# Altium schematic sheet NG2092_SD_Card.SchDoc: =project_title
size Tabloid; PageSetup: Record=PageOptions|CenterHorizontal=True|CenterVertical=True|PrintScale=0.73|XCorrection=1.00|YCorrection=1.00|PrintKind=0|BorderSize=5000000|LeftOffset=0|BottomOffset=0|Orientation=2|PaperLength=1000|PaperWidth=1000|Scale=100|PaperSource=7|PrintQuality=-4|MediaType=1|DitherType=10|PaperKind=A4|PrintScaleMode=1; CompanyName: Luxonis Holding; Organization: Luxonis Holding; Address1: 1925 Harmony Park Drive; Address2: Westminster, CO; Address3: 80234; Address4: United States; SheetNumber: 8; SheetTotal: 12
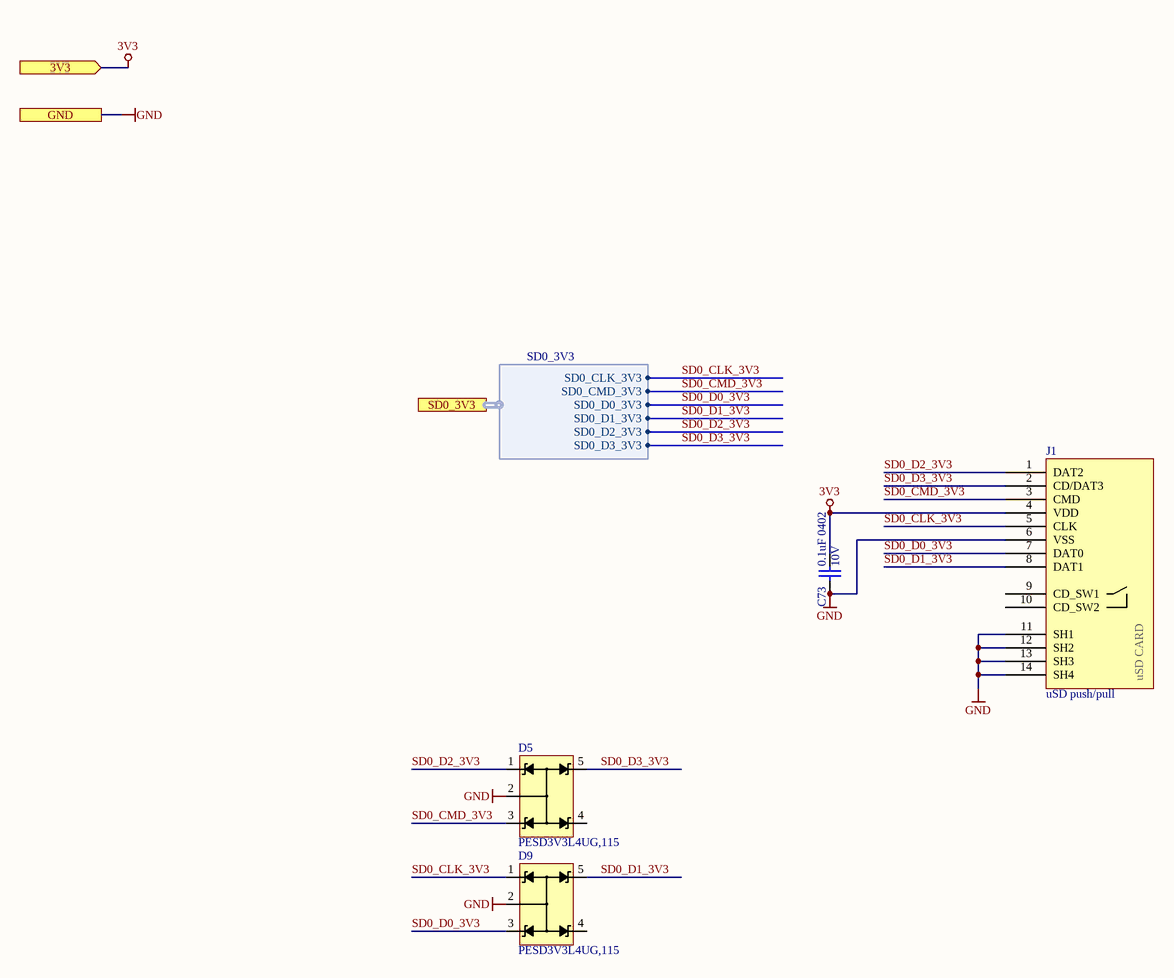
[diagram p0: NG2092_SD_Card.SchDoc]

## Parts
C73  0.1uF 0402  Voltage Rating: 10V  [CAPC0402(1005)70_L]
D5  PESD3V3L4UG,115  [PESD3V3L4UG,115]
D9  PESD3V3L4UG,115  [PESD3V3L4UG,115]
J1  uSD push/pull  [104031-0811]

## Ports
3V3 (in), GND, SD0_3V3 (harness SD0_3V3)

## Harnesses
SD0_3V3: SD0_CLK_3V3, SD0_CMD_3V3, SD0_D0_3V3, SD0_D1_3V3, SD0_D2_3V3, SD0_D3_3V3

## Nets
3V3: C73.2 J1.4(VDD) ; port 3V3
GND: C73.1 D5.2 D9.2 J1.6(VSS) J1.11(SH1) J1.12(SH2) J1.13(SH3) J1.14(SH4) ; port GND
SD0_CLK_3V3: D9.1 J1.5(CLK) ; port SD0_3V3.SD0_CLK_3V3
SD0_CMD_3V3: D5.3 J1.3(CMD) ; port SD0_3V3.SD0_CMD_3V3
SD0_D0_3V3: D9.3 J1.7(DAT0) ; port SD0_3V3.SD0_D0_3V3
SD0_D1_3V3: D9.5 J1.8(DAT1) ; port SD0_3V3.SD0_D1_3V3
SD0_D2_3V3: D5.1 J1.1(DAT2) ; port SD0_3V3.SD0_D2_3V3
SD0_D3_3V3: D5.5 J1.2(CD/DAT3) ; port SD0_3V3.SD0_D3_3V3

Not connected (* = marked no-connect by the designer): D5 4; D9 4; J1 9(CD_SW1) 10(CD_SW2)

## Notes on the sheet
- Title
- Size:
- Date:
- Tabloid
- Number:
- Time:
- Revision:
- Sheet
- of
- Drawn by:
- (in symbol 104031-0811) uSD CARD

## Library data of the parts
C73 = GRM155R71A104JA01D: CAP CER 0.1UF 10V X7R 0402 5%; Manufacturer 1: Murata; Capacitance: 100nF; Supplier 1: Digi-Key; Manufacturer Part Number 1: GRM155R71A104JA01D; Stock 1: 1346709; Pricing 1: 1=0.10000, 10=0.02500, 100=0.01130, 500=0.00806, 1000=0.00633, 2500=0.00575, 5000=0.00529 (USD); RoHS: Yes; Mount: Surface Mount; Case/Package: 0402; Case Code (Imperial): 0402; Case Code (Metric): 1005; Min Operating Temperature: -55°C; Max Operating Temperature: 125°C; Tolerance: 5%; Packaging: Tape and Reel; Voltage Rating (DC): 10V; Dielectric: X7R; Package Quantity: 10000; Termination: SMD/SMT; Length: 1mm; Height: 0.5mm; Width: 0.02inch; Thickness: 0.022inch; Depth: 0.5mm; Radiation Hardening: No; Lead Free: Lead Free; ComponentLink1URL: https://datasheet.ciiva.com/5411/product-5411135.pdf?src-supplier=Mouser; ComponentLink1Description: https://datasheet.ciiva.com/5411/product-5411135.pdf?src-supplier=Mouser; ComponentLink2URL: https://datasheet.ciiva.com/11618/c02e-11618821.pdf?src-supplier=Avnet; ComponentLink2Description: https://datasheet.ciiva.com/11618/c02e-11618821.pdf?src-supplier=Avnet; Supplier Part Number 1: 490-10777-1-ND
D5 D9 = PESD3V3L4UG,115: TVS DIODE 3V3 8V 5TSSOP; Manufacturer 1: Nexperia; Supplier 1: Digi-Key; Manufacturer Part Number 1: PESD3V3L4UG,115; Category: ESD and Circuit Protection ICs; ComponentLink1URL: https://www.mouser.com/ds/2/302/PESDXL5UF_V_Y-63173.pdf?src-supplier=Mouser; ComponentLink1Description: https://www.mouser.com/ds/2/302/PESDXL5UF_V_Y-63173.pdf?src-supplier=Mouser; Supplier Part Number 1: 1727-3827-2-ND
J1 = 104031-0811: CONN MICRO SD CARD PUSH-PULL R/A; Manufacturer 1: Molex; Supplier 1: Digi-Key; Manufacturer Part Number 1: 104031-0811; Stock 1: 19400; Pricing 1: 1=2.02000, 10=1.82900, 25=1.71680, 50=1.64220, 100=1.56760, 250=1.41828, 500=1.30630, 1000=1.11969 (USD); RoHS: Yes; Supplier 2: Newark; Supplier 3: Mouser; Supplier Part Number 1: WM6357CT-ND; Supplier Part Number 2: 99R5410; Supplier Part Number 3: 538-104031-0811